# EasyEDA Pro project Class D Amp..eprj

# Schematic Schematic1
Board Name: Board1; Create Date: 2025-09-10; Page Name: P1; Project Name: Class D Amp.; Schematic Name: Schematic1; Update Date: 2025-09-10; Company: EasyEDA.com; Page Size: A4; Version: V1.0
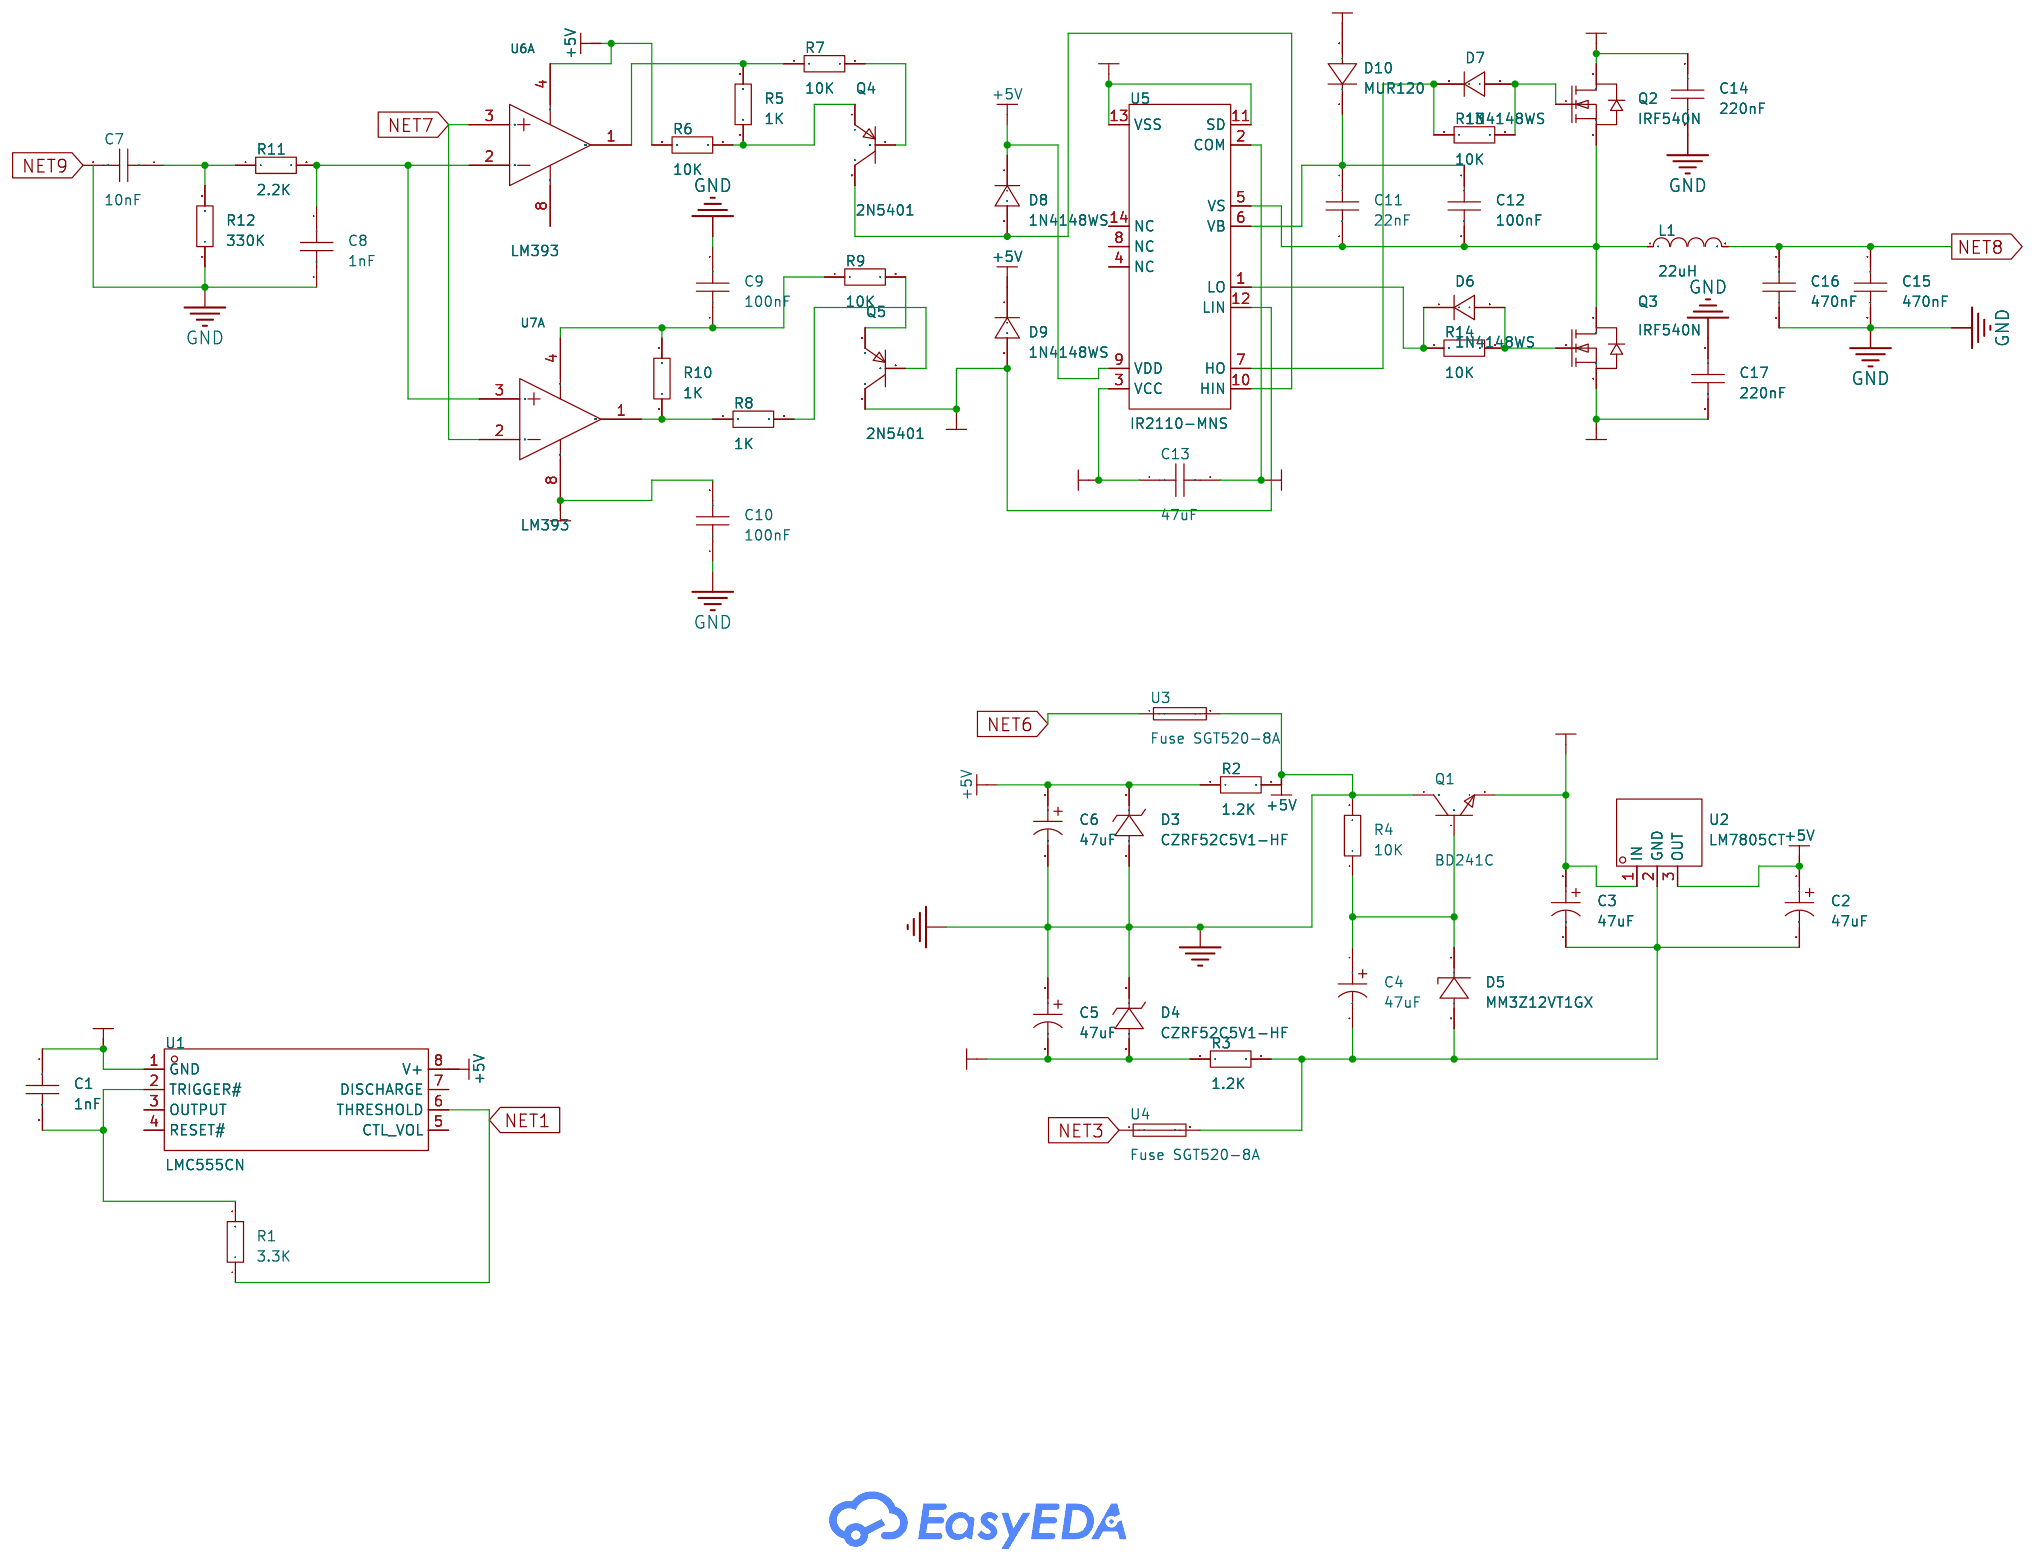
[diagram p0: schematic sheet]

## Parts
C1  1nF  [C0603]
C2  47uF  [CAP-TH_BD6.3-P2.50-D0.6-FD]
C3  47uF  [CAP-TH_BD6.3-P2.50-D0.6-FD]
C4  47uF  [CAP-TH_BD6.3-P2.50-D0.6-FD]
C5  47uF  [CAP-TH_BD6.3-P2.50-D0.6-FD]
C6  47uF  [CAP-TH_BD6.3-P2.50-D0.6-FD]
C7  10nF  [C0603]
C8  1nF  [C0603]
C9  100nF  [C0603]
C10  100nF  [C0603]
C11  22nF  [C0603]
C12  100nF  [C0603]
C13  47uF  [C0603]
C14  220nF  [C0603]
C15  470nF  [C0603]
C16  470nF  [C0603]
C17  220nF  [C0603]
D3  CZRF52C5V1-HF  [SOD-323F_L2.5-W1.2-LS2.5-RD]
D4  CZRF52C5V1-HF  [SOD-323F_L2.5-W1.2-LS2.5-RD]
D5  MM3Z12VT1GX  [SOD-323_L1.8-W1.3-LS2.5-RD]
D6  1N4148WS  [SOD-323_L1.8-W1.3-LS2.5-RD]
D7  1N4148WS  [SOD-323_L1.8-W1.3-LS2.5-RD]
D8  1N4148WS  [SOD-323_L1.8-W1.3-LS2.5-RD]
D9  1N4148WS  [SOD-323_L1.8-W1.3-LS2.5-RD]
D10  MUR120  [DO-41_BD2.4-L4.7-P8.70-D0.9-RD]
L1  22uH  [L0603]
Q1  BD241C  [TO-220-3_L10.0-W4.5-P2.54-L]
Q2  IRF540N  [TO-220-3_L10.2-W4.6-P2.54-L]
Q3  IRF540N  [TO-220-3_L10.2-W4.6-P2.54-L]
Q4  2N5401  [TO-92-3_L4.5-W3.5-P1.27-L]
Q5  2N5401  [TO-92-3_L4.5-W3.5-P1.27-L]
R1  3.3K  [R0603]
R2  1.2K  [R0603]
R3  1.2K  [R0603]
R4  10K  [R0603]
R5  1K  [R0603]
R6  10K  [R0603]
R7  10K  [R0603]
R8  1K  [R0603]
R9  10K  [R0603]
R10  1K  [R0603]
R11  2.2K  [R0603]
R12  330K  [R0603]
R13  10K  [R0603]
R14  10K  [R0603]
U1  LMC555CN  [DIP-8_L9.7-W6.4-P2.54-LS7.6-BL]
U2  LM7805CT  [TO-220-3_L10.0-W4.5-P2.54-L]
U3  Fuse SGT520-8A  [FUSE-SMD_L20.0-W5.2]
U4  Fuse SGT520-8A  [FUSE-SMD_L20.0-W5.2]
U5  IR2110-MNS  [PDIP-14_L19.2-W6.6-P2.54-LS7.6-BL]
U6  LM393  [SOP-8_L4.9-W3.9-P1.27-LS6.0-BL]  (section 1)
U7  LM393  [SOP-8_L4.9-W3.9-P1.27-LS6.0-BL]  (section 1)

## Library data of the parts
C1 C7-C17 = CAP_0603: Supplier Footprint: 0603
C2-C6 = ERA63V47M6X12: LCSC Part Name: 47uF ±20% 63V; Supplier Part: C49256820; Manufacturer: JIERR(捷而瑞); Supplier Footprint: 插件,D6.3xL12mm; JLCPCB Part Class: Extended Part; Datasheet: https://item.szlcsc.com/datasheet/ERA63V47M6X12/51692220.html; Supplier: LCSC; Tolerance: ±20%; Voltage Rating: 63V; Pin Spacing: 2.5mm; Diameter: 6.3mm; Height - Seated (Max): 12mm; Lifetime: 2000hrs@105℃; Operating Temperature: -40℃~+105℃
D3 D4 = CZRF52C5V1-HF: Supplier Part: C7156504; Manufacturer: Comchip(典琦); Supplier Footprint: 1005(SOD-323F); JLCPCB Part Class: Extended Part; Datasheet: https://atta.szlcsc.com/upload/public/pdf/source/20220509/305F2C6520B7857D6DECDCB73076522A.pdf; Supplier: LCSC; Zener Voltage (Nom): 5.1V; Reverse Leakage Current (Ir): 100nA@800mV; Power Dissipation: 200mW; Zener Impedance (Zzt): 60Ω
D5 = MM3Z12VT1GX: Supplier Part: C7303014; Manufacturer: Nexperia(安世); Supplier Footprint: SOD-323; JLCPCB Part Class: Extended Part; Datasheet: https://atta.szlcsc.com/upload/public/pdf/source/20230809/7A1198181D9F0DEEF50EE3426862A8B9.pdf; Supplier: LCSC; Zener Voltage (Nom): 12V; Reverse Leakage Current (Ir): 100nA@9V; Power Dissipation: 300mW; Zener Impedance (Zzt): 10Ω
D6-D9 = 1N4148WS_C2128: LCSC Part Name: 丝印T4 1N4148WS; Supplier Part: C2128; Manufacturer: CJ(江苏长电/长晶); Supplier Footprint: SOD-323; JLCPCB Part Class: Basic Part; Datasheet: https://item.szlcsc.com/datasheet/1N4148WS/2485.html; Supplier: LCSC; Diode Configuration: Independent; Voltage - Forward(Vf@If): 1.25V@150mA; Voltage - DC Reverse(Vr): 100V; Current - Rectified: 150mA; Pd - Power Dissipation: 200mW; Reverse Leakage Current (Ir): 1uA@75V; Reverse Recovery Time (trr): 4ns; Non-Repetitive Peak Forward Surge Current: 2A
D10 = MUR120: LCSC Part Name: 耐压:200V 电流:1A 反向恢复时间：25ns; Supplier Part: C961850; Manufacturer: YANGJIE(扬杰); Supplier Footprint: DO-41; JLCPCB Part Class: Extended Part; Datasheet: https://item.szlcsc.com/datasheet/MUR120/1042171.html; Supplier: LCSC; Diode Configuration: Independent; Voltage - Forward(Vf@If): 875mV@1mA; Voltage - DC Reverse(Vr): 200V; Current - Rectified: 1A; Reverse Leakage Current (Ir): 5uA@200V; Reverse Recovery Time (trr): 25ns; Operating Junction Temperature Range: -55℃~+150℃@(Tj); Non-Repetitive Peak Forward Surge Current: 35A
L1 = L_0603
Q1 = BD241C: Supplier Part: C2907646; Manufacturer: SPTECH(深圳质超); Supplier Footprint: TO-220C; JLCPCB Part Class: Extended Part; Datasheet: https://atta.szlcsc.com/upload/public/pdf/source/20241108/EBDBC24D27A5E0247151F85310DDFA07.pdf; Supplier: LCSC
Q2 Q3 = IRF540N_C41430602: LCSC Part Name: 1个N沟道 耐压:100V 电流:45A; Supplier Part: C41430602; Manufacturer: DOINGTER(杜因特); Supplier Footprint: TO-220; JLCPCB Part Class: Extended Part; Datasheet: https://item.szlcsc.com/datasheet/IRF540N/43287069.html; Supplier: LCSC; Number: 1 N-Channel; Drain to Source Voltage: 100V; Current - Continuous Drain(Id): 45A; RDS(on): 16mΩ@10V; Pd - Power Dissipation: 95W; Gate Threshold Voltage (Vgs(th)): 2.2V@250uA; Gate Charge(Qg): 15.6nC@10V; Input Capacitance(Ciss): 916pF@25V; Reverse Transfer Capacitance (Crss@Vds): 36pF@25V; Operating Temperature: -55℃~+150℃; Type: N-Channel
Q4 Q5 = 2N5401: Supplier Part: C2936033; Manufacturer: Slkor(萨科微); Supplier Footprint: TO-92-3; JLCPCB Part Class: Extended Part; Datasheet: https://item.szlcsc.com/datasheet/2N5401/3287708.html; Supplier: LCSC; type: PNP; Current - Collector(Ic): 600mA; Collector - Emitter Voltage VCEO: 150V; Pd - Power Dissipation: 625mW; DC Current Gain: 60@10mA,5V; Transition frequency(fT): 300MHz; Current - Collector Cutoff: 50nA; Vce Saturation(VCE(sat)): 500mV@50mA,5mA; Emitter-Base Voltage(Vebo): 5V; Number: 1 PNP
R1-R14 = Res_0603: Supplier Footprint: 0603
U1 = LMC555CN: Supplier Part: C3304077; Manufacturer: TI(德州仪器); Supplier Footprint: PDIP-8; JLCPCB Part Class: Extended Part; Supplier: LCSC; Operating Temperature: -40℃~+85℃
U2 = LM7805CT: LCSC Part Name: 输入35V 输出5V 1A; Supplier Part: C22146; Supplier Footprint: TO-220; JLCPCB Part Class: Extended Part; Datasheet: https://atta.szlcsc.com/upload/public/pdf/source/20140508/1457707058114.pdf; Supplier: LCSC; Output Type: Fixed; Voltage - Supply: 35V; Output Voltage: 5V; Output Current: 1A; Power Supply Rejection Ratio (PSRR): 80dB@(120Hz); Voltage Dropout: 2V@(1A); Output Configuration: Positive electrode; Number of Outputs: 1
U3 U4 = Fuse SGT520-8A: LCSC Part Name: 8A 250VAC 慢断; Supplier Part: C2997196; Manufacturer: SET(赛尔特); Supplier Footprint: D5.2xL20mm; JLCPCB Part Class: Extended Part; Datasheet: https://item.szlcsc.com/datasheet/Fuse%2520SGT520-8A/3466294.html; Supplier: LCSC; Type: Glass Tube Fuse; Current Rating: 8A; Voltage Rating (AC): 250V; Operating Temperature: -55℃~+125℃; Interrupt Rating: 8A@250VAC
U5 = IR2110-MNS: Supplier Part: C47967292; Manufacturer: minos(迈诺斯); Supplier Footprint: DIP-14; JLCPCB Part Class: Extended Part; Datasheet: https://item.szlcsc.com/datasheet/IR2110-MNS/50203552.html; Supplier: LCSC
U6 U7 = LM393_C5252905: LCSC Part Name: 单电源电压范围:2V~32V LM393; Supplier Part: C5252905; Manufacturer: MSKSEMI(美森科); Supplier Footprint: SOP-8; JLCPCB Part Class: Extended Part; Datasheet: https://item.szlcsc.com/datasheet/LM393/5971206.html; Supplier: LCSC; Number of Channels: 2; Vos - Input Offset Voltage: 1mV; Ib - Input Bias Current: 100nA; Quiescent Current: 600uA; Operating Temperature: 0℃~+70℃

## Nets
+5V: C2.1 C5.1 C6.1 C6.2 D3.1(K) D3.2(A) D4.1(K) D8.1(K) D9.1(K) Q1.2(C) R2.1 R2.2 R4.2 R6.1 U1.8(V+) U2.3(OUT) U3.2 U5.9(VDD) U6.4(VEE)
+12V: C3.1 C13.1 D10.2(A) Q1.3(E) U2.1(IN) U5.3(VCC)
+30V: C14.1 Q2.2(D)
-5V: C1.1 C5.2 C10.2 D4.2(A) R3.1 U1.1(GND) U7.8(VCC)
-30V: C13.2 C17.2 D9.2(A) Q3.3(S) Q5.3(C) U5.2(COM) U5.11(SD) U5.12(LIN) U5.13(VSS)
GND: C8.2 C9.2 C10.1 C14.2 C15.2 C16.2 C17.1 R12.1
NET1: R1.1 U1.6(THRESHOLD)
NET3: U4.1
NET6: U3.1
NET7: U6.3(1IN+) U7.2(1IN-)
NET8: C15.1 C16.1 L1.2
NET9: C7.2
$1N225: C1.2 R1.2 U1.2(TRIGGER#)
$1N1179: C2.2 C3.2 C4.2 D5.2(A) R3.2 U2.2(GND) U4.2
$1N1275: C4.1 D5.1(K) Q1.1(B) R4.1
$1N3389: Q4.1(E) R5.1 R6.2
$1N3419: R5.2 R7.1 U6.1(1OUT1)
$1N3423: Q4.2(B) R7.2
$1N3550: R8.1 R10.1 U7.1(1OUT1)
$1N3603: Q5.2(B) R8.2
$1N3618: C9.1 R9.1 R10.2 U7.4(VEE)
$1N3685: Q5.1(E) R9.2
$1N3754: C8.1 R11.2 U6.2(1IN-) U7.3(1IN+)
$1N3862: C7.1 R11.1 R12.2
$1N4041: C11.2 C12.2 L1.1 Q2.3(S) Q3.2(D) U5.5(VS)
$1N4050: C11.1 C12.1 D10.1(K) U5.6(VB)
$1N4186: D7.2(A) Q2.1(G) R13.2
$1N4284: D6.2(A) Q3.1(G) R14.2
$1N4296: D6.1(K) R14.1 U5.1(LO)
$1N4354: D7.1(K) R13.1 U5.7(HO)
$1N4387: D8.2(A) Q4.3(C) U5.10(HIN)

Not connected (* = marked no-connect by the designer): U1 3(OUTPUT) 4(RESET#) 5(CTL_VOL) 7(DISCHARGE); U5 4(NC) 8(NC) 14(NC); U6 8(VCC)

# Board PCB1
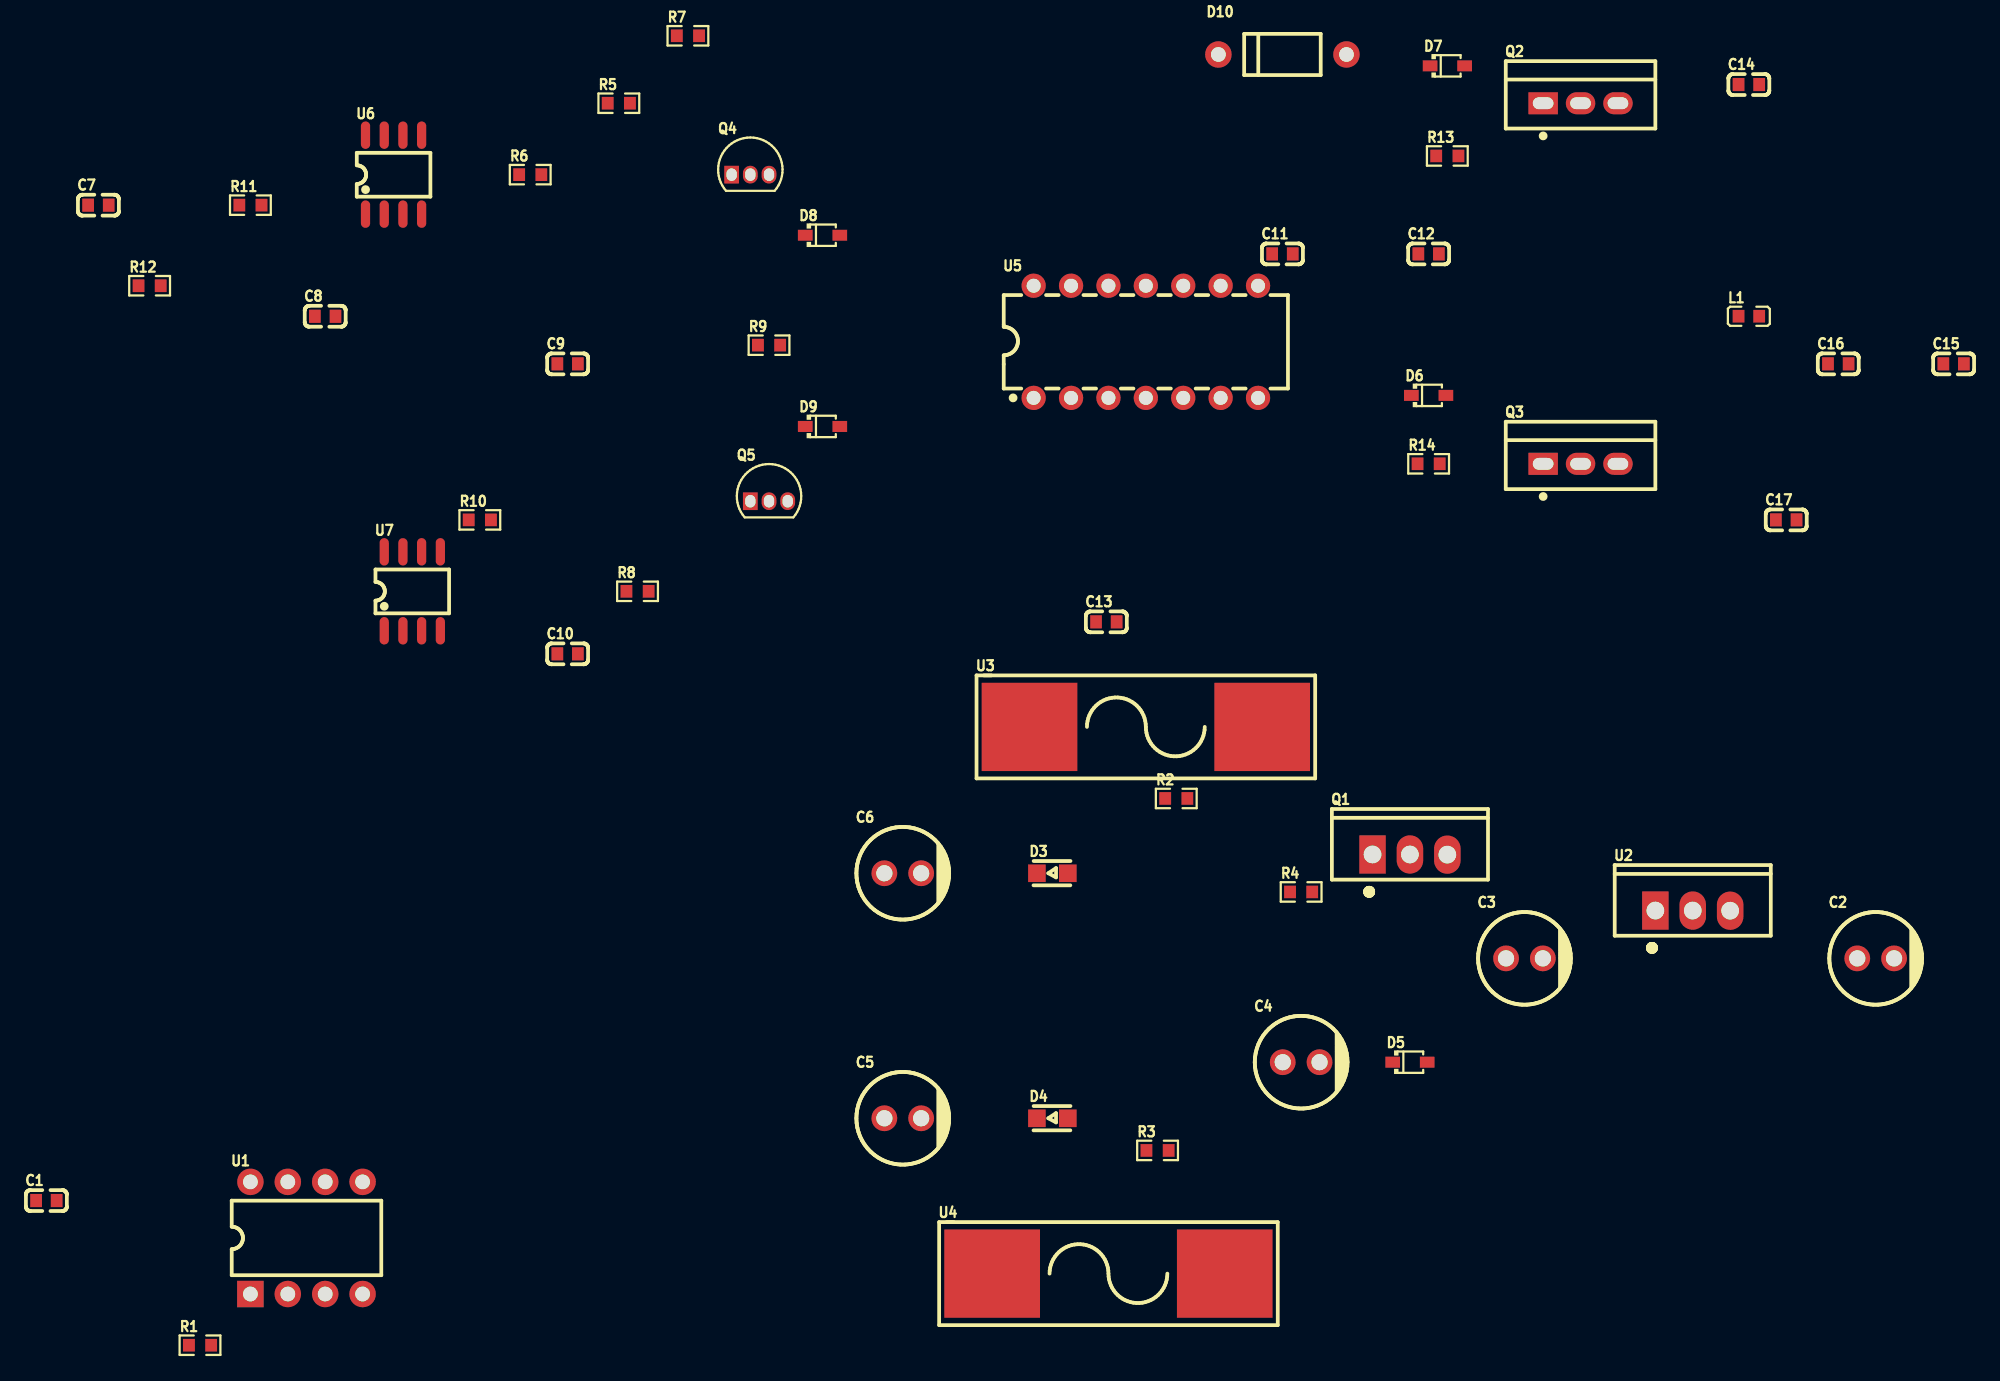
[diagram p1: board, top side]
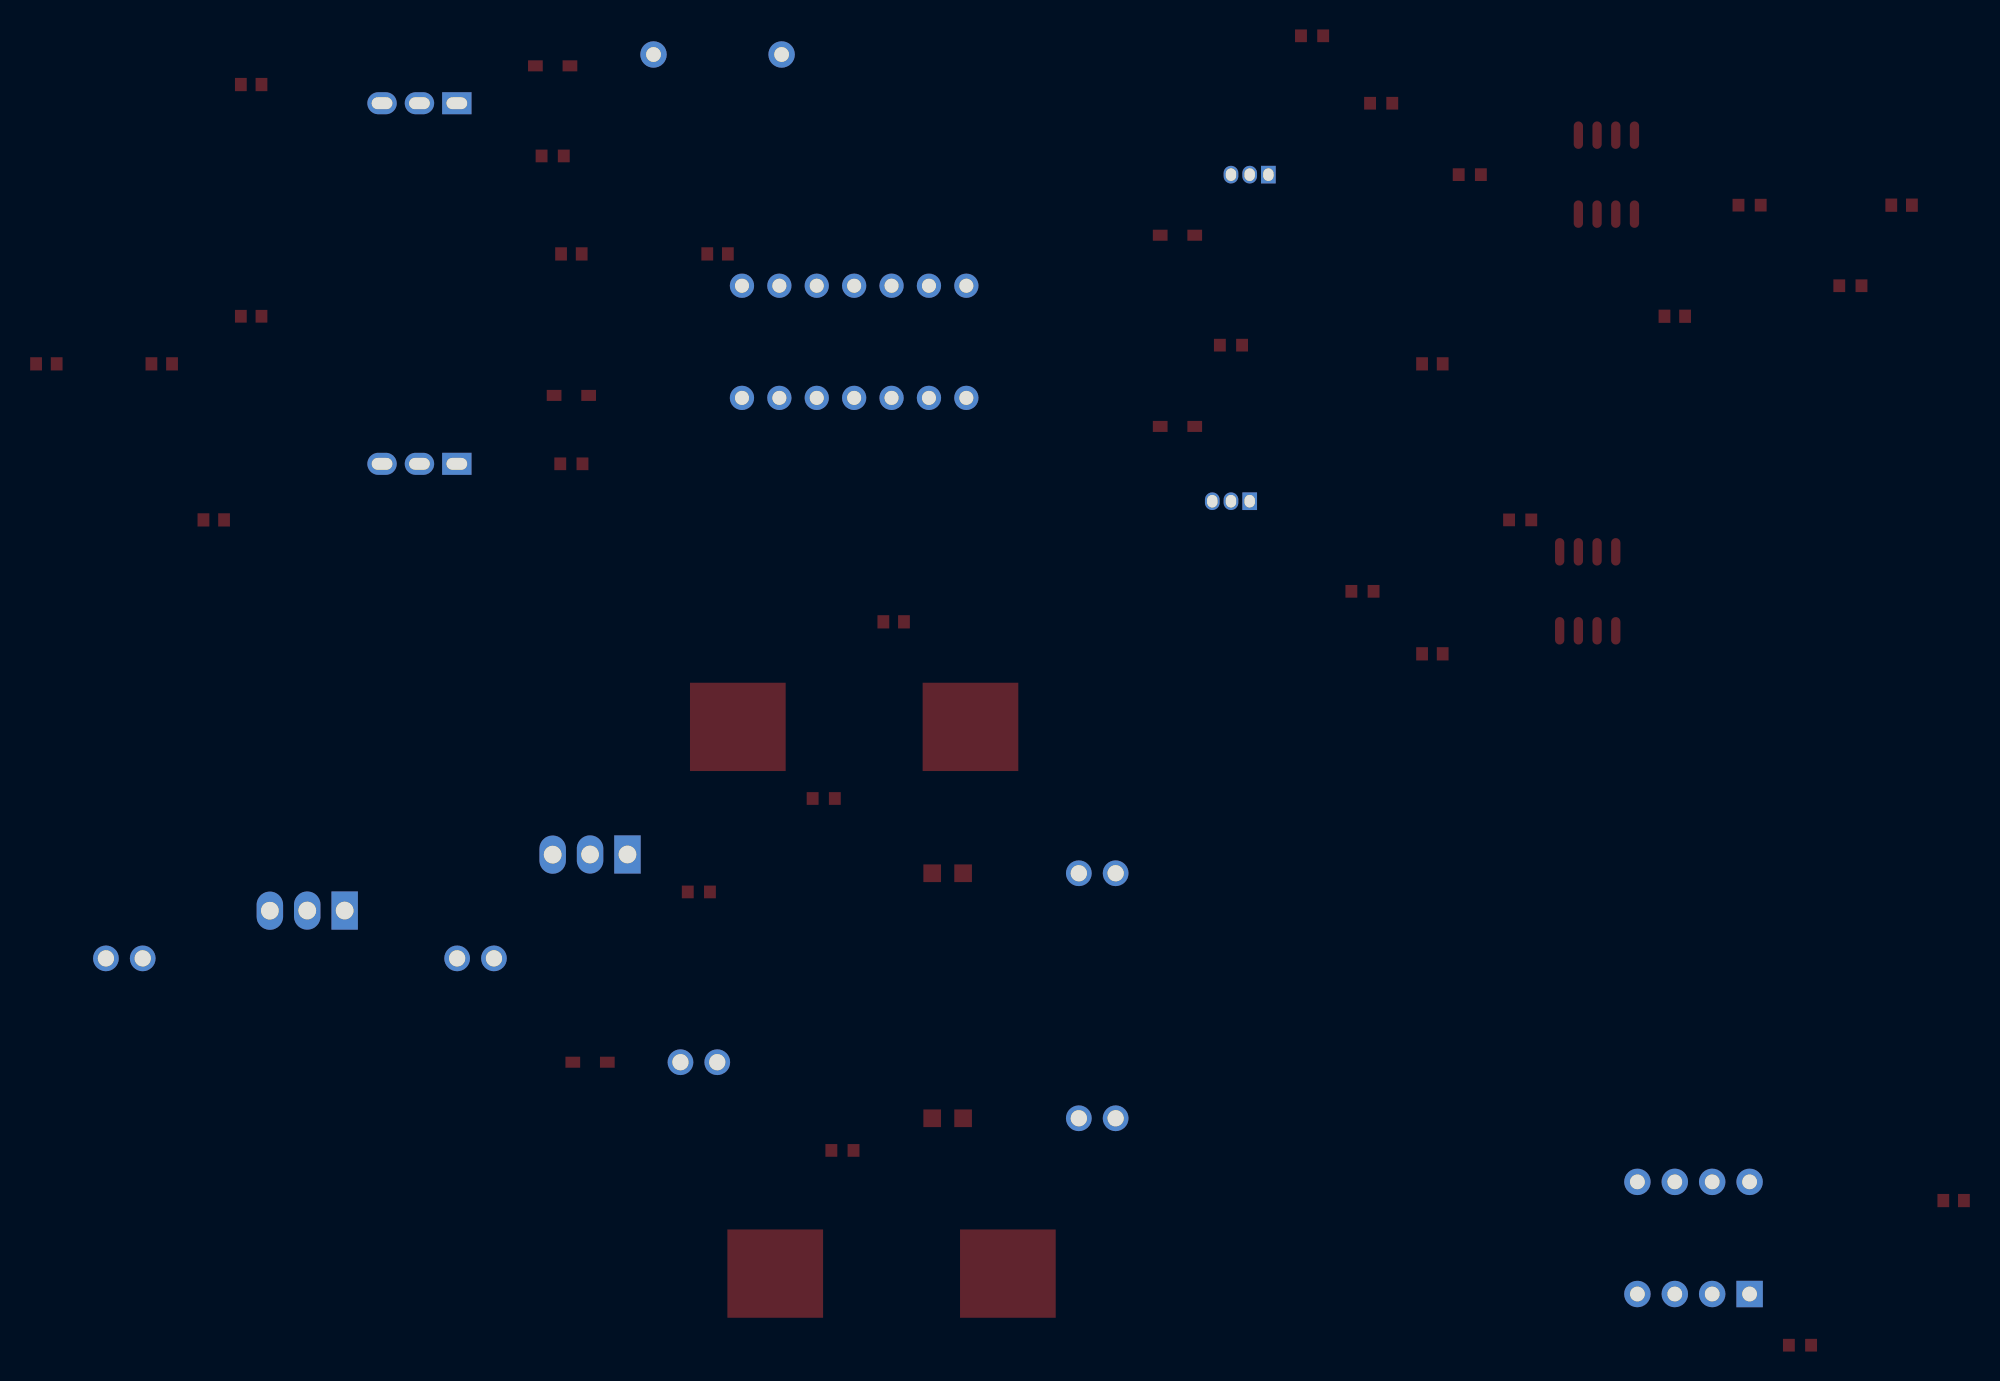
[diagram p2: board, bottom side, seen from below]

No outline. copper layers: Top Layer, Bottom Layer. Coordinates in mm from the lowest, leftmost part position.
Stack: Top Layer 0.035mm / Dielectric1 1.51mm FR4 er 4.5 / Bottom Layer 0.035mm

## Design rules (mm)
template: JLCPCB Capability(Two Layers Board)
spacing copperThickness1oz (default): track to track 0.102, other pairs 0.152 to 0.3
spacing copperThickness2oz: track to track 0.203, other pairs 0.152 to 0.3
track width copperThickness1oz (default): min 0.127, default 0.254, max 2.54
track width copperThickness2oz: min 0.203, default 0.254, max 2.54
differential pair differentialPair (default): width min 0.127, default 0.254, max 2.54; gap min 0.152, default 0.152
via viaSize (default): diameter min 0.5, default 0.61, max 10; hole min 0.3, default 0.305, max 6.3

## Placement (name value [footprint] x y rotation side)
C1  1nF  [C0603]  0 9.83 0 top
C2  47uF  [CAP-TH_BD6.3-P2.50-D0.6-FD]  124.24 26.28 0 top
C3  47uF  [CAP-TH_BD6.3-P2.50-D0.6-FD]  100.39 26.28 0 top
C4  47uF  [CAP-TH_BD6.3-P2.50-D0.6-FD]  85.22 19.23 0 top
C5  47uF  [CAP-TH_BD6.3-P2.50-D0.6-FD]  58.16 15.42 0 top
C6  47uF  [CAP-TH_BD6.3-P2.50-D0.6-FD]  58.16 32.07 0 top
C7  10nF  [C0603]  3.53 77.46 0 top
C8  1nF  [C0603]  18.94 69.91 0 top
C9  100nF  [C0603]  35.4 66.68 0 top
C10  100nF  [C0603]  35.4 46.97 0 top
C11  22nF  [C0603]  83.95 74.15 0 top
C12  100nF  [C0603]  93.88 74.15 0 top
C13  47uF  [C0603]  71.99 49.15 0 top
C14  220nF  [C0603]  115.63 85.65 0 top
C15  470nF  [C0603]  129.54 66.68 0 top
C16  470nF  [C0603]  121.7 66.68 0 top
C17  220nF  [C0603]  118.17 56.07 0 top
D3  CZRF52C5V1-HF  [SOD-323F_L2.5-W1.2-LS2.5-RD]  68.32 32.07 0 top
D4  CZRF52C5V1-HF  [SOD-323F_L2.5-W1.2-LS2.5-RD]  68.32 15.42 0 top
D5  MM3Z12VT1GX  [SOD-323_L1.8-W1.3-LS2.5-RD]  92.61 19.23 0 top
D6  1N4148WS  [SOD-323_L1.8-W1.3-LS2.5-RD]  93.88 64.53 0 top
D7  1N4148WS  [SOD-323_L1.8-W1.3-LS2.5-RD]  95.15 86.92 0 top
D8  1N4148WS  [SOD-323_L1.8-W1.3-LS2.5-RD]  52.72 75.42 0 top
D9  1N4148WS  [SOD-323_L1.8-W1.3-LS2.5-RD]  52.72 62.42 0 top
D10  MUR120  [DO-41_BD2.4-L4.7-P8.70-D0.9-RD]  83.95 87.7 0 top
L1  22uH  [L0603]  115.63 69.91 0 top
Q1  BD241C  [TO-220-3_L10.0-W4.5-P2.54-L]  92.61 33.34 0 top
Q2  IRF540N  [TO-220-3_L10.2-W4.6-P2.54-L]  104.2 84.38 0 top
Q3  IRF540N  [TO-220-3_L10.2-W4.6-P2.54-L]  104.2 59.88 0 top
Q4  2N5401  [TO-92-3_L4.5-W3.5-P1.27-L]  47.81 79.53 0 top
Q5  2N5401  [TO-92-3_L4.5-W3.5-P1.27-L]  49.08 57.34 0 top
R1  3.3K  [R0603]  10.43 0 0 top
R2  1.2K  [R0603]  76.74 37.15 0 top
R3  1.2K  [R0603]  75.47 13.23 0 top
R4  10K  [R0603]  85.22 30.8 0 top
R5  1K  [R0603]  38.88 84.38 0 top
R6  10K  [R0603]  32.86 79.53 0 top
R7  10K  [R0603]  43.57 88.97 0 top
R8  1K  [R0603]  40.15 51.22 0 top
R9  10K  [R0603]  49.08 67.95 0 top
R10  1K  [R0603]  29.44 56.07 0 top
R11  2.2K  [R0603]  13.86 77.46 0 top
R12  330K  [R0603]  7.01 71.98 0 top
R13  10K  [R0603]  95.15 80.8 0 top
R14  10K  [R0603]  93.88 59.88 0 top
U1  LMC555CN  [DIP-8_L9.7-W6.4-P2.54-LS7.6-BL]  17.67 7.29 0 top
U2  LM7805CT  [TO-220-3_L10.0-W4.5-P2.54-L]  111.82 29.53 0 top
U3  Fuse SGT520-8A  [FUSE-SMD_L20.0-W5.2]  74.67 42.01 0 top
U4  Fuse SGT520-8A  [FUSE-SMD_L20.0-W5.2]  72.13 4.86 0 top
U5  IR2110-MNS  [PDIP-14_L19.2-W6.6-P2.54-LS7.6-BL]  74.67 68.17 0 top
U6  LM393  [SOP-8_L4.9-W3.9-P1.27-LS6.0-BL]  23.58 79.53 0 top
U7  LM393  [SOP-8_L4.9-W3.9-P1.27-LS6.0-BL]  24.85 51.22 0 top

## Footprints (pads in the part's own frame, mm; a bottom-side part is the same pattern mirrored in y, then rotated)
C0603
  rect 0.8x0.9 smd: 1(-0.7,0) 2(0.7,0)
CAP-TH_BD6.3-P2.50-D0.6-FD
  round 1.75 hole 1.1: 1(-1.25,0) 2(1.25,0)
DIP-8_L9.7-W6.4-P2.54-LS7.6-BL
  rect 1.8x1.8 hole 1: 1(-3.81,-3.81)
  round 1.8 hole 1: 2(-1.27,-3.81) 3(1.27,-3.81) 4(3.81,-3.81) 5(3.81,3.81) 6(1.27,3.81) 7(-1.27,3.81) 8(-3.81,3.81)
DO-41_BD2.4-L4.7-P8.70-D0.9-RD
  round 1.8 hole 1: 1(-4.35,0) 2(4.35,0)
FUSE-SMD_L20.0-W5.2
  rect 6.5x6 smd: 1(-7.9,0) 2(7.9,0)
L0603
  rect 0.8x0.864 smd: 1(-0.7,0) 2(0.7,0)
PDIP-14_L19.2-W6.6-P2.54-LS7.6-BL
  round 1.65 hole 0.95: 1(-7.62,-3.81) 2(-5.08,-3.81) 3(-2.54,-3.81) 4(0,-3.81) 5(2.54,-3.81) 6(5.08,-3.81) 7(7.62,-3.81) 8(7.62,3.81) 9(5.08,3.81) 10(2.54,3.81) 11(0,3.81) 12(-2.54,3.81) 13(-5.08,3.81) 14(-7.62,3.81)
R0603
  rect 0.806x0.864 smd: 1(-0.753,0) 2(0.753,0)
SOD-323_L1.8-W1.3-LS2.5-RD
  rect 1x0.75 smd: 1(-1.173,0) 2(1.173,0)
SOD-323F_L2.5-W1.2-LS2.5-RD
  rect 1.2x1.2 smd: 1(-1.05,0) 2(1.05,0)
SOP-8_L4.9-W3.9-P1.27-LS6.0-BL
  oval 0.63x1.865 smd: 1(-1.905,-2.683) 2(-0.635,-2.683) 3(0.635,-2.683) 4(1.905,-2.683) 5(1.905,2.683) 6(0.635,2.683) 7(-0.635,2.683) 8(-1.905,2.683)
TO-92-3_L4.5-W3.5-P1.27-L
  rect 1x1.2 hole 0.7x0.85: 1(-1.27,0)
  oval 1x1.2 hole 0.7x0.85: 2(0,0) 3(1.27,0)
TO-220-3_L10.0-W4.5-P2.54-L
  rect 1.8x2.6 hole 1.2: 1(-2.54,0.005)
  oval 1.8x2.6 hole 1.2: 2(0,0.005) 3(2.54,-0.005)
TO-220-3_L10.2-W4.6-P2.54-L
  rect 2x1.5 hole 1.4x0.8: 1(-2.54,0)
  oval 2x1.5 hole 1.4x0.8: 2(0,0) 3(2.54,0)

## Nets
As in the schematic.

Pads without a net: U1 3 4 5 7; U5 4 8 14; U6 5 6 7 8; U7 5 6 7
